# Altium project Carduino_Pi_v1.PrjPcb
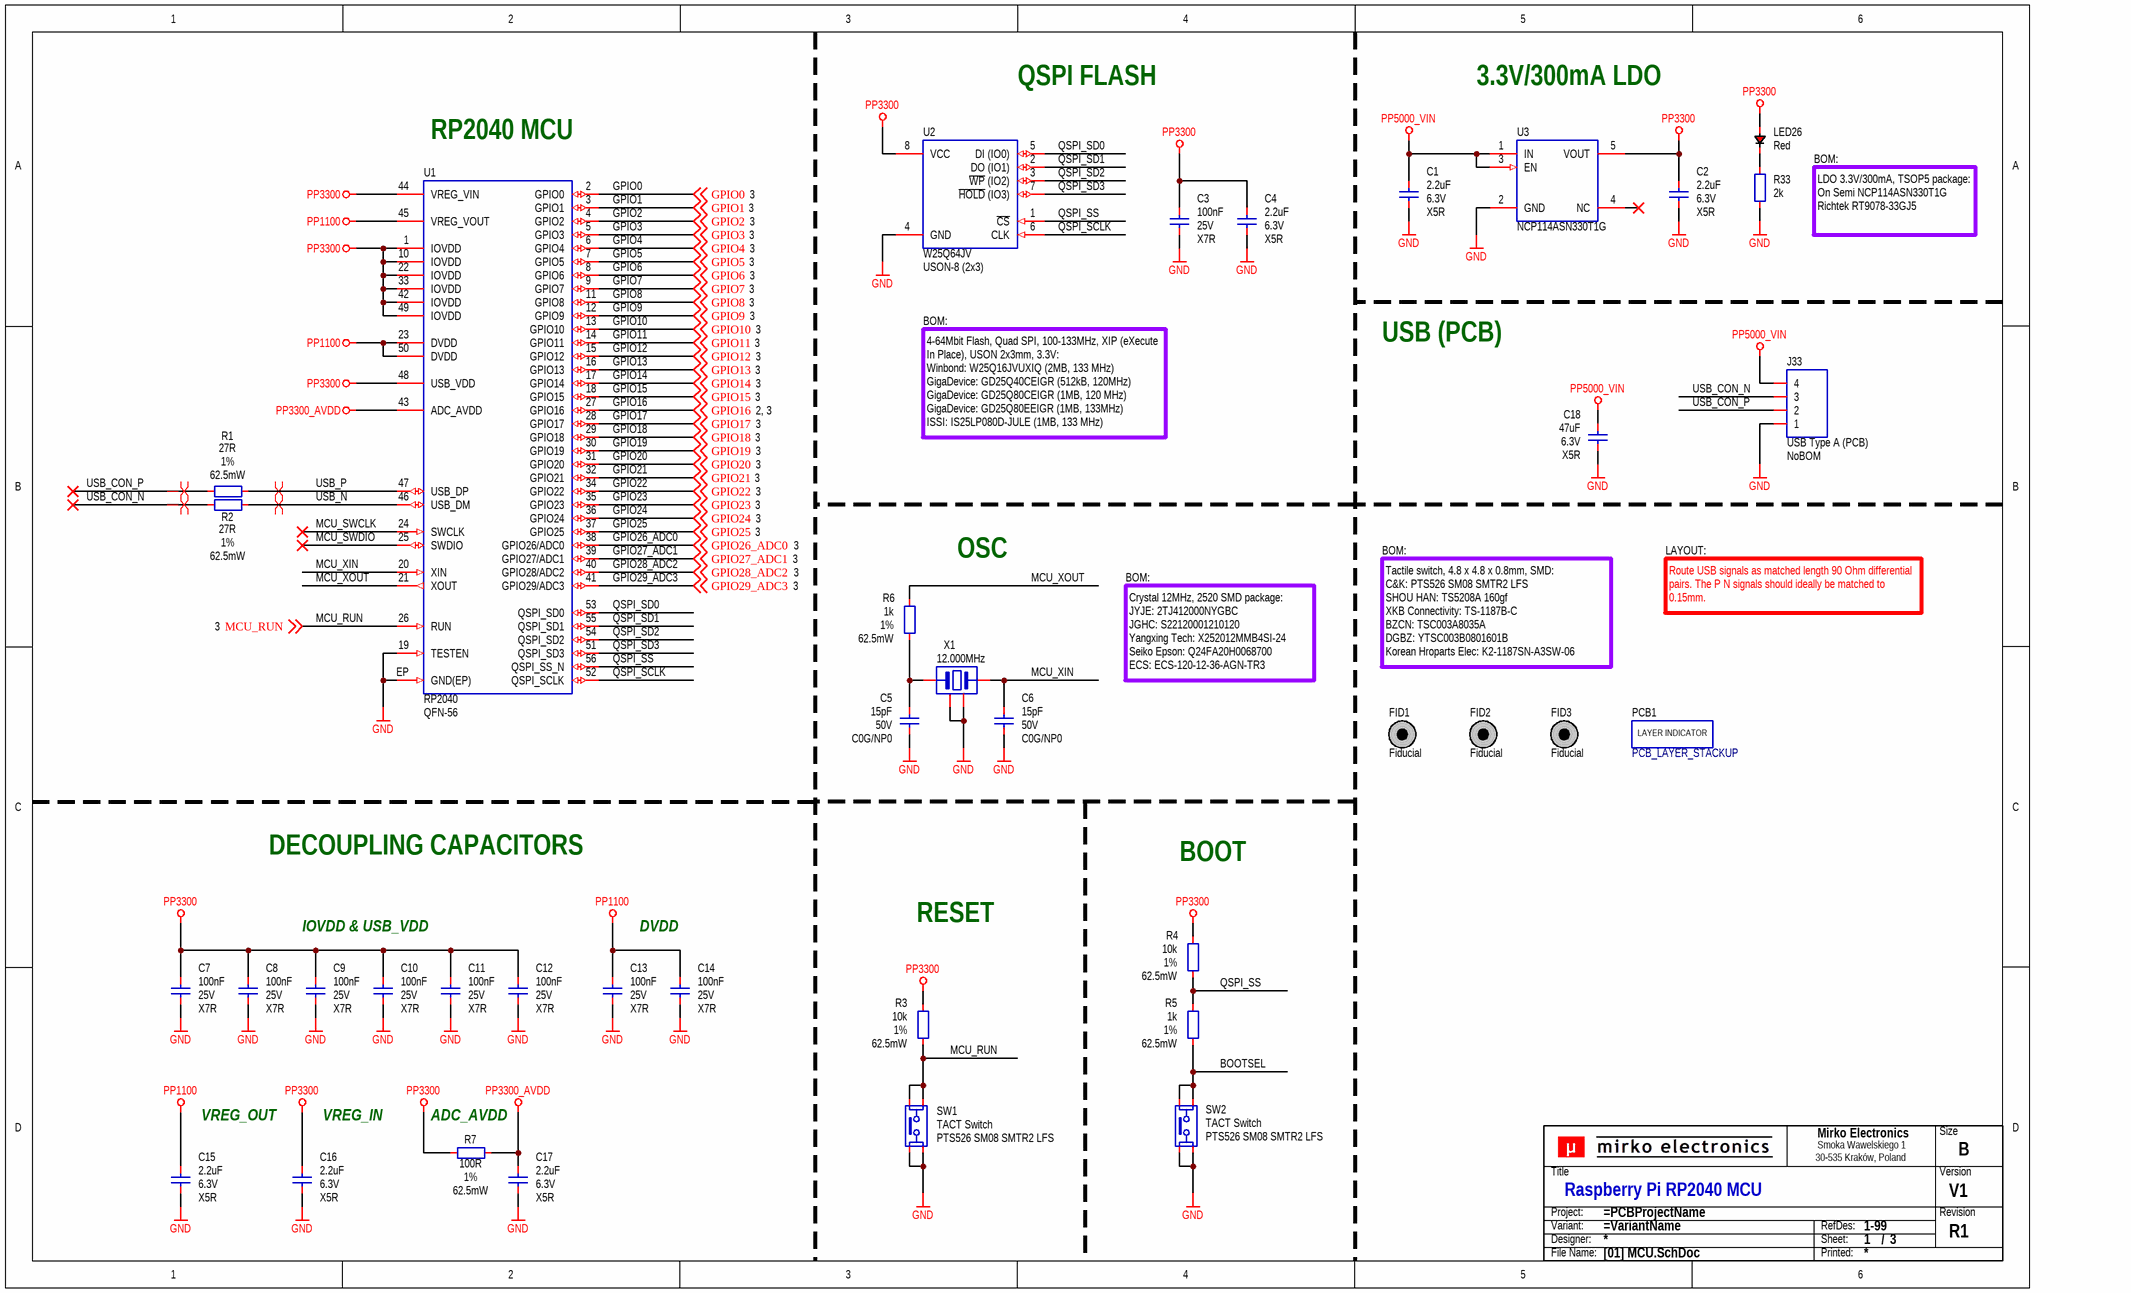
[diagram p0: [01] MCU.SchDoc]
SchPcbRevision: R1; SchPcbVersion: V1
3 sheets, 101 parts. Net scope: global (net labels, ports and power ports of the same name join across sheets).
Board files: Carduino_Pi_v1.PcbDoc, Carduino_Pi_v1_panel.PcbDoc
Sheets:
  [01] MCU.SchDoc
  [02] LED.SchDoc
  [03] Arduino.SchDoc

## Sheet [01] MCU.SchDoc: Raspberry Pi RP2040 MCU
size B; DocumentNumber: 1; SheetNumber: 1; SheetTotal: 3; PageSize: B; Designators: 1-99

### Parts
(Parts that share a designator on the sheet are numbered #1, #2 ... from top to bottom, then left to right.)
C1  2.2uF  Voltage Rating: 6.3V  Dielectric: X5R  [CAP_0402_R]
C2  2.2uF  Voltage Rating: 6.3V  Dielectric: X5R  [CAP_0402_R]
C3  100nF  Voltage Rating: 25V  Dielectric: X7R  [CAP_0402_R]
C4  2.2uF  Voltage Rating: 6.3V  Dielectric: X5R  [CAP_0402_R]
C5  15pF  Voltage Rating: 50V  Dielectric: C0G/NP0  [CAP_0402_R]
C6  15pF  Voltage Rating: 50V  Dielectric: C0G/NP0  [CAP_0402_R]
C7  100nF  Voltage Rating: 25V  Dielectric: X7R  [CAP_0402_R]
C8  100nF  Voltage Rating: 25V  Dielectric: X7R  [CAP_0402_R]
C9  100nF  Voltage Rating: 25V  Dielectric: X7R  [CAP_0402_R]
C10  100nF  Voltage Rating: 25V  Dielectric: X7R  [CAP_0402_R]
C11  100nF  Voltage Rating: 25V  Dielectric: X7R  [CAP_0402_R]
C12  100nF  Voltage Rating: 25V  Dielectric: X7R  [CAP_0402_R]
C13  100nF  Voltage Rating: 25V  Dielectric: X7R  [CAP_0402_R]
C14  100nF  Voltage Rating: 25V  Dielectric: X7R  [CAP_0402_R]
C15  2.2uF  Voltage Rating: 6.3V  Dielectric: X5R  [CAP_0402_R]
C16  2.2uF  Voltage Rating: 6.3V  Dielectric: X5R  [CAP_0402_R]
C17  2.2uF  Voltage Rating: 6.3V  Dielectric: X5R  [CAP_0402_R]
C18  47uF  Voltage Rating: 6.3V  Dielectric: X5R  [CAP_0603_R]
FID1  Fiducial  [PCB_FID_RND_100x300]  (no BOM)
FID2  Fiducial  [PCB_FID_RND_100x300]  (no BOM)
FID3  Fiducial  [PCB_FID_RND_100x300]  (no BOM)
J33  USB Type A (PCB)  BOM: NoBOM  [PCB_USB_SMD_TYPE_A_4P]  (no BOM)
LED26  Red  [LED_0402_R]
PCB1  PCB_LAYER_STACKUP  [PCB_STACKUP-2L_A1]  (no BOM)
R1  27R  Tolerance: 1%  Power Rating: 62.5mW  [RES_0402_R]
R2  27R  Tolerance: 1%  Power Rating: 62.5mW  [RES_0402_R]
R3  10k  Tolerance: 1%  Power Rating: 62.5mW  [RES_0402_R]
R4  10k  Tolerance: 1%  Power Rating: 62.5mW  [RES_0402_R]
R5  1k  Tolerance: 1%  Power Rating: 62.5mW  [RES_0402_R]
R6  1k  Tolerance: 1%  Power Rating: 62.5mW  [RES_0402_R]
R7  100R  Tolerance: 1%  Power Rating: 62.5mW  [RES_0402_R]
R33  2k  [RES_0402_R]
SW1  TACT Switch  MPN: PTS526 SM08 SMTR2 LFS  [SWI_C&K_PTS526SX08]
SW2  TACT Switch  MPN: PTS526 SM08 SMTR2 LFS  [SWI_C&K_PTS526SX08]
TB?#1  Title block  (value not drawn)  (graphical)
U1  RP2040  Package (Case): QFN-56  [ICC_QFN56_700X700X90_P40_EP_RP2040]
U2  W25Q64JV  Package: USON-8 (2x3)  [ICC_USON8_200X300X55P50_EP]
U3  NCP114ASN330T1G  [ICC_TSOT-5_290X160H110_P95]
X1  12.000MHz  [OSC_2520_4P_250X200H50_R]

### Nets
GND: C1.1 C2.1 C3.1 C4.1 C5.1 C6.1 C7.1 C8.1 C9.1 C10.1 C11.1 C12.1 C13.1 C14.1 C15.1 C16.1 C17.1 C18.1 J33.1 R33.1 SW1.3 SW1.4 SW2.3 SW2.4 U1.19(TESTEN) U1.EP(GND(EP)) U2.4(GND) U3.2(GND) X1.2 X1.4
PP1100: C13.2 C14.2 C15.2 U1.23(DVDD) U1.45(VREG_VOUT) U1.50(DVDD)
PP3300: C2.2 C3.2 C4.2 C7.2 C8.2 C9.2 C10.2 C11.2 C12.2 C16.2 LED26.2 R3.2 R4.2 R7.2 U1.1(IOVDD) U1.10(IOVDD) U1.22(IOVDD) U1.33(IOVDD) U1.42(IOVDD) U1.44(VREG_VIN) U1.48(USB_VDD) U1.49(IOVDD) U2.8(VCC) U3.5(VOUT)
PP3300_AVDD: C17.2 R7.1 U1.43(ADC_AVDD)
PP5000_VIN: C1.2 C18.2 J33.4 U3.1(IN) U3.3(EN)
BOOTSEL: R5.1 SW2.1 SW2.2
GPIO0: U1.2(GPIO0) ; off-sheet GPIO0
GPIO1: U1.3(GPIO1) ; off-sheet GPIO1
GPIO2: U1.4(GPIO2) ; off-sheet GPIO2
GPIO3: U1.5(GPIO3) ; off-sheet GPIO3
GPIO4: U1.6(GPIO4) ; off-sheet GPIO4
GPIO5: U1.7(GPIO5) ; off-sheet GPIO5
GPIO6: U1.8(GPIO6) ; off-sheet GPIO6
GPIO7: U1.9(GPIO7) ; off-sheet GPIO7
GPIO8: U1.11(GPIO8) ; off-sheet GPIO8
GPIO9: U1.12(GPIO9) ; off-sheet GPIO9
GPIO10: U1.13(GPIO10) ; off-sheet GPIO10
GPIO11: U1.14(GPIO11) ; off-sheet GPIO11
GPIO12: U1.15(GPIO12) ; off-sheet GPIO12
GPIO13: U1.16(GPIO13) ; off-sheet GPIO13
GPIO14: U1.17(GPIO14) ; off-sheet GPIO14
GPIO15: U1.18(GPIO15) ; off-sheet GPIO15
GPIO16: U1.27(GPIO16) ; off-sheet GPIO16
GPIO17: U1.28(GPIO17) ; off-sheet GPIO17
GPIO18: U1.29(GPIO18) ; off-sheet GPIO18
GPIO19: U1.30(GPIO19) ; off-sheet GPIO19
GPIO20: U1.31(GPIO20) ; off-sheet GPIO20
GPIO21: U1.32(GPIO21) ; off-sheet GPIO21
GPIO22: U1.34(GPIO22) ; off-sheet GPIO22
GPIO23: U1.35(GPIO23) ; off-sheet GPIO23
GPIO24: U1.36(GPIO24) ; off-sheet GPIO24
GPIO25: U1.37(GPIO25) ; off-sheet GPIO25
GPIO26_ADC0: U1.38(GPIO26/ADC0) ; off-sheet GPIO26_ADC0
GPIO27_ADC1: U1.39(GPIO27/ADC1) ; off-sheet GPIO27_ADC1
GPIO28_ADC2: U1.40(GPIO28/ADC2) ; off-sheet GPIO28_ADC2
GPIO29_ADC3: U1.41(GPIO29/ADC3) ; off-sheet GPIO29_ADC3
MCU_RUN: R3.1 SW1.1 SW1.2 U1.26(RUN) ; off-sheet MCU_RUN
MCU_SWCLK: U1.24(SWCLK)
MCU_SWDIO: U1.25(SWDIO)
MCU_XIN: C6.2 U1.20(XIN) X1.3
MCU_XOUT: R6.1 U1.21(XOUT)
QSPI_SCLK: U1.52(QSPI_SCLK) U2.6(CLK)
QSPI_SD0: U1.53(QSPI_SD0) U2.5(DI_(IO0))
QSPI_SD1: U1.55(QSPI_SD1) U2.2(DO_(IO1))
QSPI_SD2: U1.54(QSPI_SD2) U2.3(~{WP}_(IO2))
QSPI_SD3: U1.51(QSPI_SD3) U2.7(~{HOLD}_(IO3))
QSPI_SS: R4.1 R5.2 U1.56(QSPI_SS_N) U2.1(~{CS})
USB_CON_N: J33.3 R2.1
USB_CON_P: J33.2 R1.1
USB_N: R2.2 U1.46(USB_DM)
USB_P: R1.2 U1.47(USB_DP)
NetC5_2: C5.2 R6.2 X1.1
NetLED26_1: LED26.1 R33.2

Not connected (* = marked no-connect by the designer): U3 4(NC)*

### Layout directives
differential pair: USB_CON_N, USB_CON_P, USB_N, USB_P

### Notes on the sheet
- QSPI FLASH
- 3.3V/300mA LDO
- (near U1) RP2040 MCU
- BOM:
- LDO 3.3V/300mA, TSOP5 package:
  On Semi NCP114ASN330T1G
  Richtek RT9078-33GJ5
- USB (PCB)
- 4-64Mbit Flash, Quad SPI, 100-133MHz, XIP (eXecute In Place), USON 2x3mm, 3.3V:
  Winbond: W25Q16JVUXIQ (2MB, 133 MHz)
  GigaDevice: GD25Q40CEIGR (512kB, 120MHz)
  GigaDevice: GD25Q80CEIGR (1MB, 120 MHz)
  GigaDevice: GD25Q80EEIGR (1MB, 133MHz)
  ISSI: IS25LP080D-JULE (1MB, 133 MHz)
- OSC
- LAYOUT:
- Route USB signals as matched length 90 Ohm differential pairs. The P N signals should ideally be matched to 0.15mm.
- Crystal 12MHz, 2520 SMD package:
  JYJE: 2TJ412000NYGBC
  JGHC: S22120001210120
  Yangxing Tech: X252012MMB4SI-24
  Seiko Epson: Q24FA20H0068700
  ECS: ECS-120-12-36-AGN-TR3
- Tactile switch, 4.8 x 4.8 x 0.8mm, SMD:
  C&K: PTS526 SM08 SMTR2 LFS
  SHOU HAN: TS5208A 160gf
  XKB Connectivity: TS-1187B-C
  BZCN: TSC003A8035A
  DGBZ: YTSC003B0801601B
  Korean Hroparts Elec: K2-1187SN-A3SW-06
- DECOUPLING CAPACITORS
- BOOT
- IOVDD & USB_VDD
- DVDD
- RESET
- VREG_OUT
- VREG_IN
- (near R7) ADC_AVDD
- (in symbol PCB_LAYER_STACKUP) LAYER INDICATOR
- (in symbol SCH_TITLE_BLOCK_V1) Mirko Electronics; Size; Smoka Wawelskiego 1; 30-535 Kraków, Poland; Title; Version; Project:; Revision; Variant:; RefDes:; Designer:; Sheet:; /; File Name:; Printed:

### Library data of the parts
C1 C2 C4 C15-C17 = CAP-0026: Capacitor; MLCC; GENERIC; TBD; TBD; TBD; TBD; SMD; 0402 (1005);; Manufacturer: Samsung Electro-Mechanics; MPN: CL05A225MQ5NNNC; Component Body: 1.00 x 0.50mm; ID: CAP-0026; Component Type: Capacitor; Component Subtype: MLCC; Value: 2.2uF; Mounting Type: SMD; Package (Case): 0402 (1005); Component Height: TBD; Packaging Type: TBD; ROHS Status: TBD; Operating Temperature: TBD; Capacitance: 2.2uF; Tolerance: TBD; Features: TBD; Supplier 1: LCSC; Supplier 2: Farnell; Supplier Part Number 1: C107371; Supplier Part Number 2: 3013335; Supplier 3: Mouser; Supplier Part Number 3: 187-CL05A225MQ5NNNC
C3 C7-C14 = CAP-0026: Capacitor; MLCC; GENERIC; TBD; TBD; TBD; TBD; SMD; 0402 (1005);; Manufacturer: Samsung Electro-Mechanics; MPN: CL05B104KA5NNNC; Component Body: 1.00 x 0.50mm; ID: CAP-0026; Component Type: Capacitor; Component Subtype: MLCC; Value: 100nF; Mounting Type: SMD; Package (Case): 0402 (1005); Component Height: TBD; Packaging Type: TBD; ROHS Status: TBD; Operating Temperature: TBD; Capacitance: 100nF; Tolerance: TBD; Features: TBD; Supplier 1: LCSC; Supplier 2: Farnell; Supplier Part Number 1: C155422; Supplier Part Number 2: 2496772; Supplier 3: Mouser; Supplier Part Number 3: 187-CL05B104KA5NNNC
C5 C6 = CAP-0026: Capacitor; MLCC; GENERIC; TBD; TBD; TBD; TBD; SMD; 0402 (1005);; Manufacturer: KEMET Corporation; MPN: C0402C150J5GACTU; Component Body: 1.00 x 0.50mm; ID: CAP-0026; Component Type: Capacitor; Component Subtype: MLCC; Value: 15pF; Mounting Type: SMD; Package (Case): 0402 (1005); Component Height: TBD; Packaging Type: TBD; ROHS Status: TBD; Operating Temperature: TBD; Capacitance: 15pF; Tolerance: TBD; Features: TBD; Supplier 1: LCSC; Supplier 2: Farnell; Supplier Part Number 1: C106997; Supplier Part Number 2: 1414577; Supplier 3: Mouser; Supplier Part Number 3: 80-C0402C150J5G
C18 = CAP-0023: Capacitor; MLCC; GENERIC; TBD; TBD; TBD; TBD; SMD; 0603 (1608);; Manufacturer: Murata Electronics; ID: CAP-0023; Component Type: Capacitor; Component Subtype: MLCC; Value: 47uF; MPN: GENERIC; Mounting Type: SMD; Package (Case): 0603 (1608); Component Body: TBD; Component Height: TBD; Packaging Type: TBD; ROHS Status: TBD; Operating Temperature: TBD; Capacitance: 47uF; Tolerance: TBD; Features: TBD; Supplier 1: LCSC; Supplier 2: Farnell; Supplier 3: Mouser; Supplier Part Number 1: C140782; Supplier Part Number 2: 3582851; Supplier Part Number 3: 81-GRM188R60J476ME5J
FID1-FID3 = PCB_FID_RND: PCB Marking; Fiducial; Round;; Value: Fiducial; Component Subtype: -; Component Type: Fiducial; Mounting Type: -; Supplier 1: LCSC; Supplier 2: Farnell; Supplier 3: Mouser
J33 = CON_1X04_COL: Connector; 1 Row;; Value: USB Type A (PCB); Supplier 1: LCSC; Supplier 2: Farnell; Supplier 3: Mouser
LED26 = DIO_LED_RED: Diode; LED; Red;; Component Subtype: LED Diode; Package (Case): 0402 (1005); Value: Red; Component Type: LED; Mounting Type: SMD; Supplier 1: LCSC; Supplier 2: Farnell; Supplier Part Number 1: C965790; Supplier Part Number 2: 2900754; Supplier 3: Mouser; Supplier Part Number 3: 710-150040RS73240
R1 R2 = RES-0058: Resistor; Thick Film; GENERIC; TBD; TBD; TBD; TBD; TBD; SMD; 0402 (1005);; Manufacturer: Yageo Corporation; MPN: RC0402FR-0727RL; Component Body: 1.00 x 0.50mm; Voltage Rating: 50V; ID: RES-0058; Component Type: Resistor; Component Subtype: Thick Film; Value: 27R; Mounting Type: SMD; Package (Case): 0402 (1005); Component Height: TBD; Packaging Type: TBD; ROHS Status: TBD; Operating Temperature: TBD; Resistance: 27R; TCR: TBD; Features: TBD; Supplier 1: LCSC; Supplier 2: Farnell; Supplier Part Number 1: C138021; Supplier Part Number 2: 9239049; Supplier 3: Mouser; Supplier Part Number 3: 603-RC0402FR-0727RL
R3 R4 = RES-0004: Resistor; Thick Film; 10k; 1%; 62.5mW; 100PPM; 50V; Standard; SMD; 0402 (1005);; Manufacturer: Yageo Corporation; MPN: RC0402FR-0710KL; Component Body: 1.00 x 0.50mm; Packaging Type: Tape & Reel; ID: RES-0004; Component Type: Resistor; Component Subtype: Thick Film; Value: 10k; Mounting Type: SMD; Package (Case): 0402 (1005); Component Height: 0.35mm; ROHS Status: RoHS Compliant; Operating Temperature: -55°C to +155°C; Resistance: 10k; TCR: 100PPM; Voltage Rating: 50V; Features: Standard; Supplier 1: LCSC; Supplier 2: Farnell; Supplier Part Number 1: C60490; Supplier Part Number 2: 9239359; Supplier 3: Mouser; Supplier Part Number 3: 603-RC0402FR-0710KL
R5 R6 = RES-0003: Resistor; Thick Film; 1k; 1%; 62.5mW; 100PPM; 50V; Standard; SMD; 0402 (1005);; Manufacturer: Yageo Corporation; MPN: RC0402FR-071KL; Component Body: 1.00 x 0.50mm; Packaging Type: Tape & Reel; ID: RES-0003; Component Type: Resistor; Component Subtype: Thick Film; Value: 1k; Mounting Type: SMD; Package (Case): 0402 (1005); Component Height: 0.35mm; ROHS Status: RoHS Compliant; Operating Temperature: -55°C to +155°C; Resistance: 1k; TCR: 100PPM; Voltage Rating: 50V; Features: Standard; Supplier 1: LCSC; Supplier 2: Farnell; Supplier Part Number 1: C106235; Supplier Part Number 2: 9239235; Supplier 3: Mouser; Supplier Part Number 3: 603-RC0402FR-071KL
R7 = RES-0002: Resistor; Thick Film; 100R; 1%; 62.5mW; 100PPM; 50V; Standard; SMD; 0402 (1005);; Manufacturer: Yageo Corporation; MPN: RC0402FR-07100RL; Component Body: 1.00 x 0.50mm; Packaging Type: Tape & Reel; ID: RES-0002; Component Type: Resistor; Component Subtype: Thick Film; Value: 100R; Mounting Type: SMD; Package (Case): 0402 (1005); Component Height: 0.35mm; ROHS Status: RoHS Compliant; Operating Temperature: -55°C to +155°C; Resistance: 100R; TCR: 100PPM; Voltage Rating: 50V; Features: Standard; Supplier 1: LCSC; Supplier 2: Farnell; Supplier Part Number 1: C106232; Supplier Part Number 2: 2421888; Supplier 3: Mouser; Supplier Part Number 3: 603-RC0402FR-07100RL
R33 = RES-0058: Resistor; Thick Film; GENERIC; TBD; TBD; TBD; TBD; TBD; SMD; 0402 (1005);; Manufacturer: Yageo Corporation; MPN: RC0402FR-072KP; Component Body: 1.00 x 0.50mm; Tolerance: 1%; Power Rating: 62.5mW; Voltage Rating: 50V; ID: RES-0058; Component Type: Resistor; Component Subtype: Thick Film; Value: 2k; Mounting Type: SMD; Package (Case): 0402 (1005); Component Height: TBD; Packaging Type: TBD; ROHS Status: TBD; Operating Temperature: TBD; Resistance: 2k; TCR: TBD; Features: TBD; Supplier 1: LCSC; Supplier 2: Farnell; Supplier Part Number 1: C60488; Supplier Part Number 2: 1458757; Supplier 3: Mouser; Supplier Part Number 3: 603-RC0402FR-072KL
SW1 SW2 = SWI_TACT_4P_AABB: Switch; Tactile; Monostable;; Manufacturer: C&K Switches; Package (Case): 3780595; Value: TACT Switch; Component Subtype: TACT Switch; Component Type: Switch; Mounting Type: SMD; Supplier 1: LCSC; Supplier 2: Farnell; Supplier Part Number 1: C2681473; Supplier Part Number 2: 3780595; Supplier 3: Mouser; Supplier Part Number 3: 611-PTS526SM08SMTR2L
TB?#1 = SCH_TITLE_BLOCK_V1: Component Type: Title block; Manufacturer: -; Mounting Type: Non component; MPN: -; Operating Temperature: -; Package: -; Specification: Title block; Value: Title block; Replacement: -; System: ?
U1 = ICC_RPI_RP2040_QFN56: IC; MCU;; Manufacturer: Raspberry Pi; Component Subtype: MCU; Component Type: IC; Mounting Type: SMD; MPN: RP2040; Value: RP2040; Supplier 1: LCSC; Supplier Part Number 1: C2040; Supplier 2: Farnell; Supplier Part Number 2: 3766082; Supplier 3: Mouser; Supplier Part Number 3: 358-RP2040CHIP-7-500
U2 = ICC_WBD_W25Q64_SOIC_WSON: ICC; Manufacturer: Winbond Electronics; MPN: W25Q16JVUXIQ; Specification: Serial Flash memory, 64Mbit, standard-, dual-, Quad- SPI interface, 133MHz, WSON 5x6mm package; Component Type: IC; Mounting Type: SMD; Operating Temperature: -40°C to +85°C; Value: W25Q64JV; Supplier 1: LCSC; Supplier 2: Farnell; Supplier Part Number 1: C2843335; Supplier 3: Mouser; Supplier Part Number 3: 454-W25Q16JVUXIQTR
U3 = ICC_ONS_NCP114_TSOP5: ICC; LDO;; MPN: NCP114ASN330T1G; Supplier 1: LCSC; Supplier 2: Farnell; Supplier 3: Mouser; Supplier Part Number 1: C457666; Supplier Part Number 2: 2677151; Supplier Part Number 3: 863-NCP114ASN330T1G; Value: NCP114ASN330T1G
X1 = OSC_XTL_P4: Oscillator; Crystal;; Manufacturer: ECS; MPN: ECS-120-12-36-AGN-TR3; Value: 12.000MHz; Component Subtype: Crystal; Component Type: Crystal; Mounting Type: SMD; Package (Case): SMD 2520; Supplier 1: LCSC; Supplier 2: Farnell; Supplier Part Number 1: C2149205; Supplier Part Number 2: 2849406; Supplier 3: Mouser; Supplier Part Number 3: 520-120-12-36AGN-TR3
PCB1 = PCB_LAYER_STACKUP: Component Subtype: -; Component Type: PCB Marking; Mounting Type: -; Supplier 1: LCSC; Supplier 2: Farnell; Supplier 3: Mouser

## Sheet [02] LED.SchDoc: RGB Ring LED
size B; DocumentNumber: 2; SheetNumber: 2; SheetTotal: 3; PageSize: B; Designators: 1-99
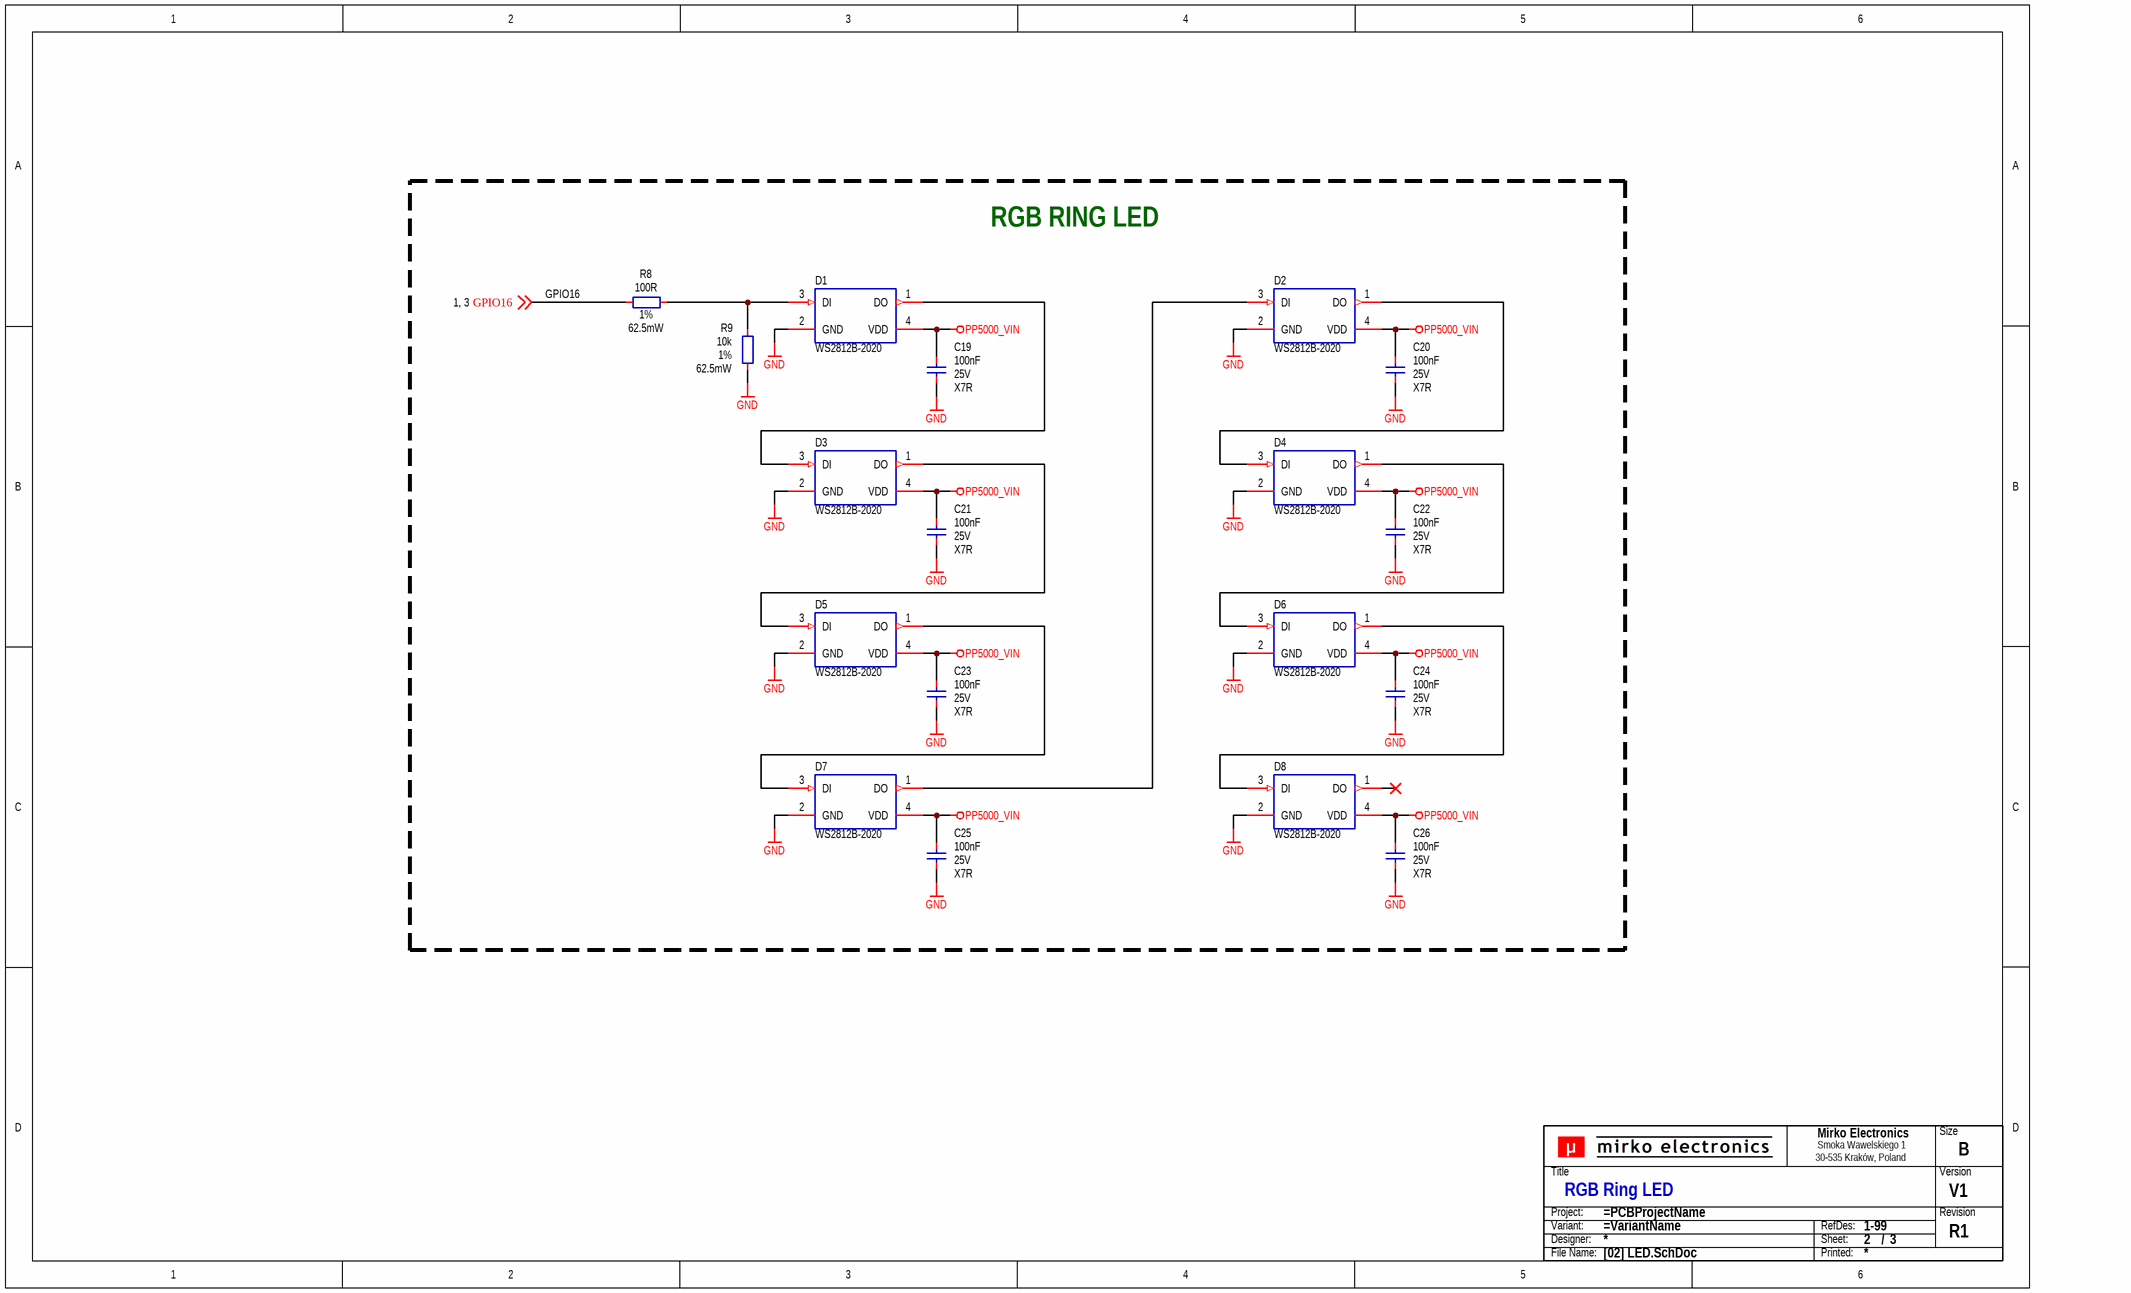
[diagram p1: [02] LED.SchDoc]

### Parts
(Parts that share a designator on the sheet are numbered #1, #2 ... from top to bottom, then left to right.)
C19  100nF  Voltage Rating: 25V  Dielectric: X7R  [CAP_0402_R]
C20  100nF  Voltage Rating: 25V  Dielectric: X7R  [CAP_0402_R]
C21  100nF  Voltage Rating: 25V  Dielectric: X7R  [CAP_0402_R]
C22  100nF  Voltage Rating: 25V  Dielectric: X7R  [CAP_0402_R]
C23  100nF  Voltage Rating: 25V  Dielectric: X7R  [CAP_0402_R]
C24  100nF  Voltage Rating: 25V  Dielectric: X7R  [CAP_0402_R]
C25  100nF  Voltage Rating: 25V  Dielectric: X7R  [CAP_0402_R]
C26  100nF  Voltage Rating: 25V  Dielectric: X7R  [CAP_0402_R]
D1  WS2812B-2020  [LED_WRD_WS2812X-2020]
D2  WS2812B-2020  [LED_WRD_WS2812X-2020]
D3  WS2812B-2020  [LED_WRD_WS2812X-2020]
D4  WS2812B-2020  [LED_WRD_WS2812X-2020]
D5  WS2812B-2020  [LED_WRD_WS2812X-2020]
D6  WS2812B-2020  [LED_WRD_WS2812X-2020]
D7  WS2812B-2020  [LED_WRD_WS2812X-2020]
D8  WS2812B-2020  [LED_WRD_WS2812X-2020]
R8  100R  Tolerance: 1%  Power Rating: 62.5mW  [RES_0402_R]
R9  10k  Tolerance: 1%  Power Rating: 62.5mW  [RES_0402_R]
TB?#2  Title block  (value not drawn)  (graphical)

### Blocks framed on the sheet
RGB RING LED: C19-C26 D1-D8 R8 R9

### Nets
GND: C19.1 C20.1 C21.1 C22.1 C23.1 C24.1 C25.1 C26.1 D1.2(GND) D2.2(GND) D3.2(GND) D4.2(GND) D5.2(GND) D6.2(GND) D7.2(GND) D8.2(GND) R9.1
PP5000_VIN: C19.2 C20.2 C21.2 C22.2 C23.2 C24.2 C25.2 C26.2 D1.4(VDD) D2.4(VDD) D3.4(VDD) D4.4(VDD) D5.4(VDD) D6.4(VDD) D7.4(VDD) D8.4(VDD)
GPIO16: R8.2 ; off-sheet GPIO16
NetD1_1: D1.1(DO) D3.3(DI)
NetD1_3: D1.3(DI) R8.1 R9.2
NetD2_1: D2.1(DO) D4.3(DI)
NetD2_3: D2.3(DI) D7.1(DO)
NetD3_1: D3.1(DO) D5.3(DI)
NetD4_1: D4.1(DO) D6.3(DI)
NetD5_1: D5.1(DO) D7.3(DI)
NetD6_1: D6.1(DO) D8.3(DI)

Not connected (* = marked no-connect by the designer): D8 1(DO)*

### Notes on the sheet
- (in symbol SCH_TITLE_BLOCK_V1) Mirko Electronics; Size; Smoka Wawelskiego 1; 30-535 Kraków, Poland; Title; Version; Project:; Revision; Variant:; RefDes:; Designer:; Sheet:; /; File Name:; Printed:

### Library data of the parts
C19-C26 = CAP-0026: as C3 on sheet [01] MCU; ID: CAP-0026; Component Type: Capacitor; Component Subtype: MLCC; Value: 100nF; Mounting Type: SMD; Package (Case): 0402 (1005); Component Height: TBD; Packaging Type: TBD; ROHS Status: TBD; Operating Temperature: TBD; Capacitance: 100nF; Tolerance: TBD; Features: TBD; Supplier 1: LCSC; Supplier 2: Farnell; Supplier Part Number 1: C155422; Supplier Part Number 2: 2496772; Supplier 3: Mouser; Supplier Part Number 3: 187-CL05B104KA5NNNC
D1-D8 = LED_WRD_WS2812B-2020: LED; RGB; Manufacturer: Worldsemi; Specification: Digital LED RGB diode, 12mA, 800kbps, SMD 2020 package; Cross Refference: NO; Component Type: LED Diode; Mounting Type: SMD; MPN: WS2812B-2020; Operating Temperature: -25°C to +85°C; Package (Case): SMD 2020; Value: WS2812B-2020; Supplier 1: LCSC; Supplier Part Number 1: C965555; Supplier 2: Farnell; Supplier 3: Mouser; Supplier Part Number 3: 485-4684 (10-pack)
R8 = RES-0002: as R7 on sheet [01] MCU; ID: RES-0002; Component Type: Resistor; Component Subtype: Thick Film; Value: 100R; Mounting Type: SMD; Package (Case): 0402 (1005); Component Height: 0.35mm; ROHS Status: RoHS Compliant; Operating Temperature: -55°C to +155°C; Resistance: 100R; TCR: 100PPM; Voltage Rating: 50V; Features: Standard; Supplier 1: LCSC; Supplier 2: Farnell; Supplier Part Number 1: C106232; Supplier Part Number 2: 2421888; Supplier 3: Mouser; Supplier Part Number 3: 603-RC0402FR-07100RL
R9 = RES-0004: as R3 on sheet [01] MCU; ID: RES-0004; Component Type: Resistor; Component Subtype: Thick Film; Value: 10k; Mounting Type: SMD; Package (Case): 0402 (1005); Component Height: 0.35mm; ROHS Status: RoHS Compliant; Operating Temperature: -55°C to +155°C; Resistance: 10k; TCR: 100PPM; Voltage Rating: 50V; Features: Standard; Supplier 1: LCSC; Supplier 2: Farnell; Supplier Part Number 1: C60490; Supplier Part Number 2: 9239359; Supplier 3: Mouser; Supplier Part Number 3: 603-RC0402FR-0710KL
TB?#2 = SCH_TITLE_BLOCK_V1: Component Type: Title block; Manufacturer: -; Mounting Type: Non component; MPN: -; Operating Temperature: -; Package: -; Specification: Title block; Value: Title block; Replacement: -; System: ?

## Sheet [03] Arduino.SchDoc: Arduino Uno socket
size B; DocumentNumber: 3; SheetNumber: 3; SheetTotal: 3; Designators: 1-99; PageSize: B
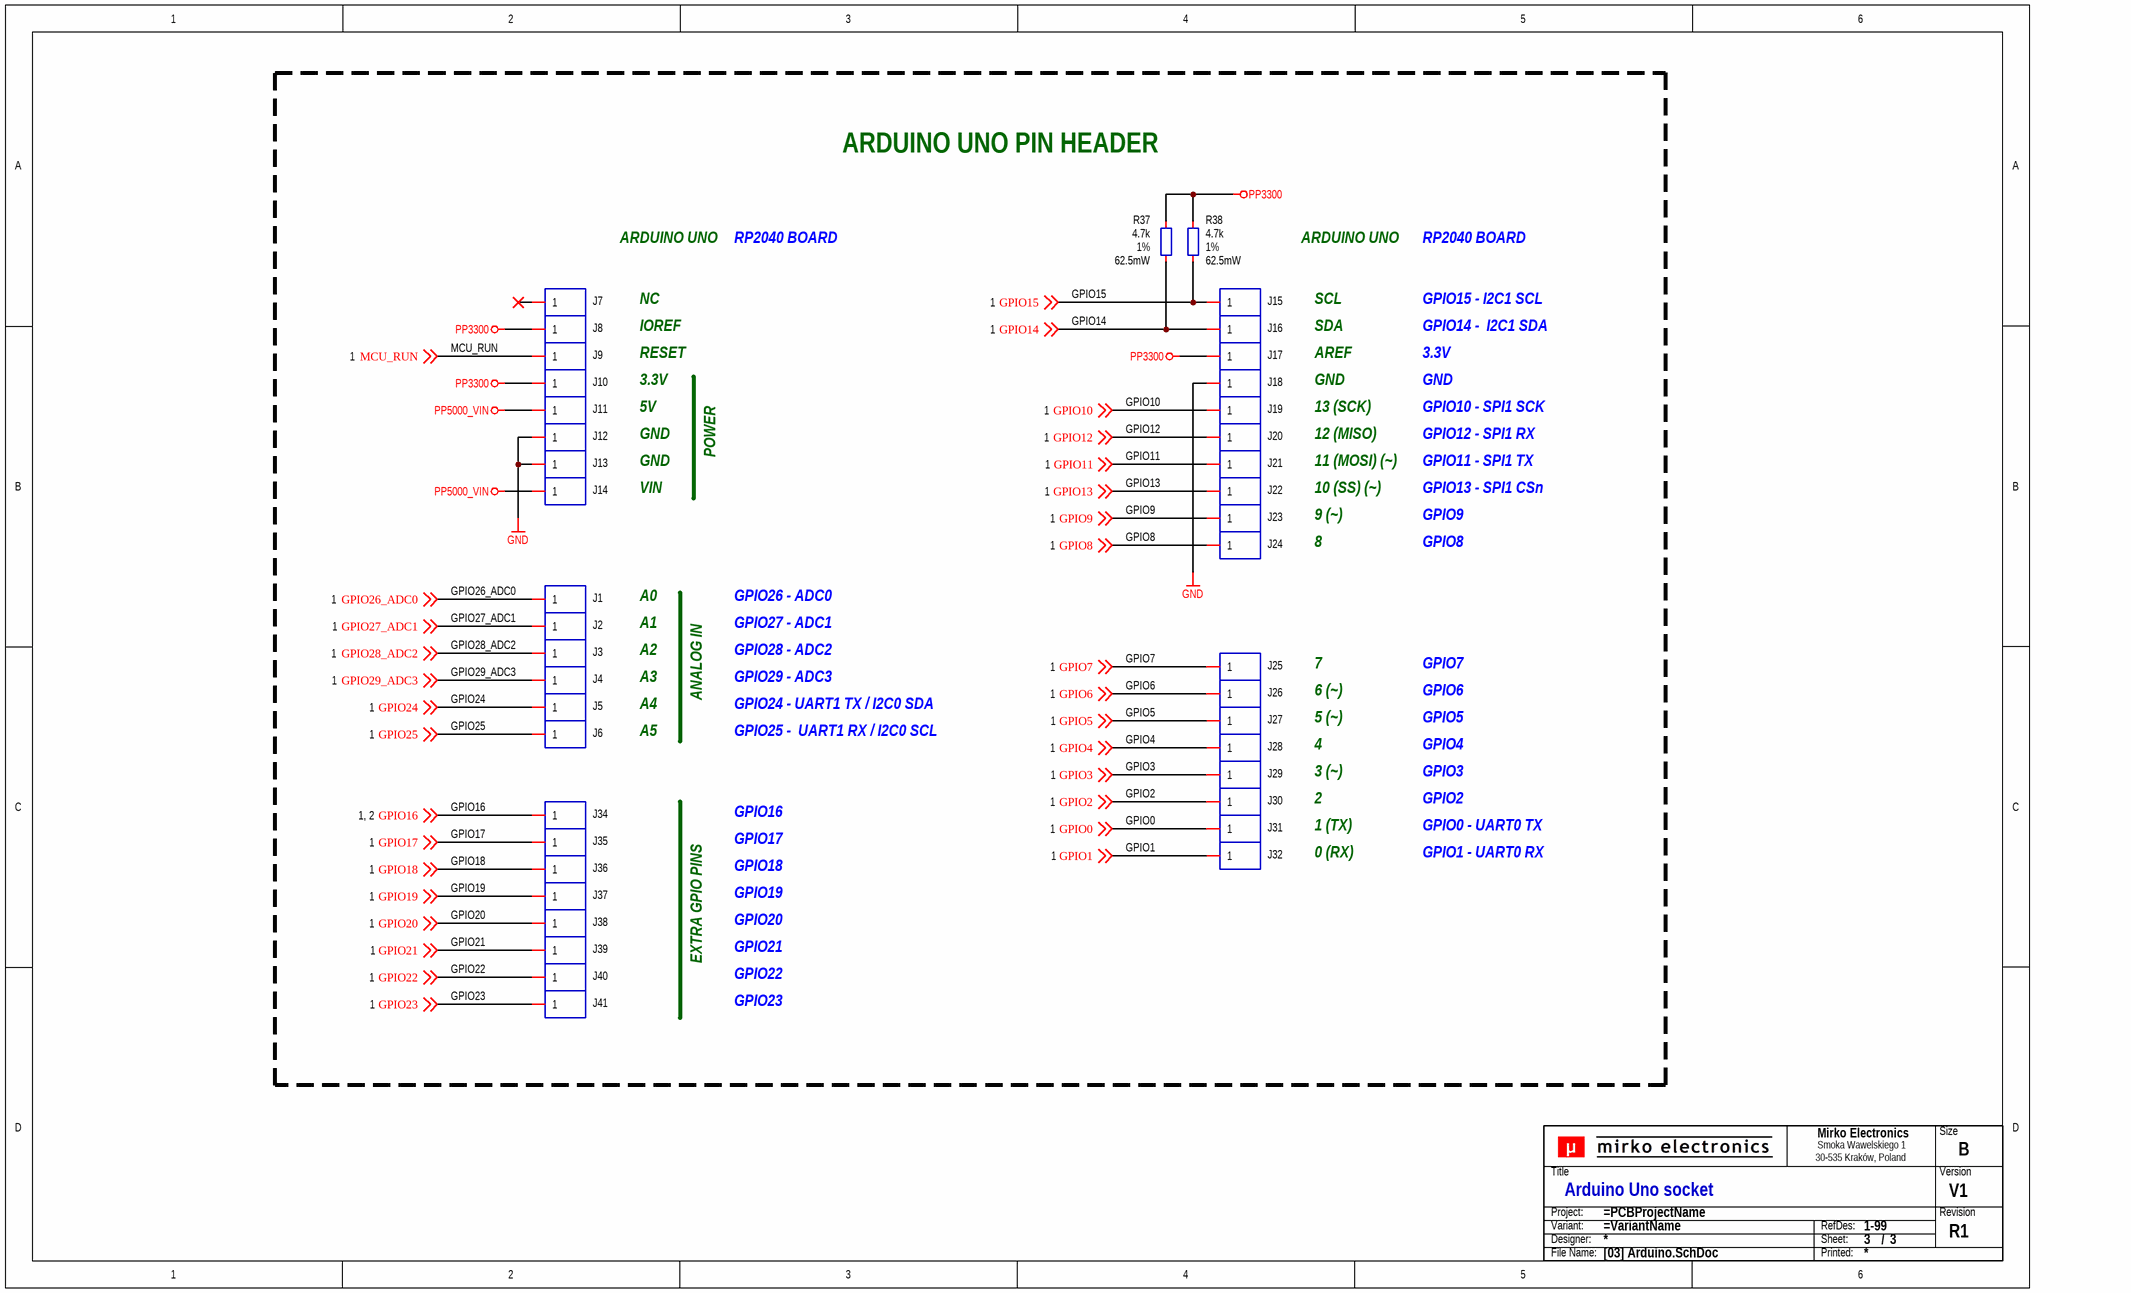
[diagram p2: [03] Arduino.SchDoc]

### Parts
(Parts that share a designator on the sheet are numbered #1, #2 ... from top to bottom, then left to right.)
J1  (no value)  [PCB_PAD_THT_280X180H100_RND]  (no BOM)
J2  (no value)  [PCB_PAD_THT_280X180H100_RND]  (no BOM)
J3  (no value)  [PCB_PAD_THT_280X180H100_RND]  (no BOM)
J4  (no value)  [PCB_PAD_THT_280X180H100_RND]  (no BOM)
J5  (no value)  [PCB_PAD_THT_280X180H100_RND]  (no BOM)
J6  (no value)  [PCB_PAD_THT_280X180H100_RND]  (no BOM)
J7  (no value)  [PCB_PAD_THT_280X180H100_RND]  (no BOM)
J8  (no value)  [PCB_PAD_THT_280X180H100_RND]  (no BOM)
J9  (no value)  [PCB_PAD_THT_280X180H100_RND]  (no BOM)
J10  (no value)  [PCB_PAD_THT_280X180H100_RND]  (no BOM)
J11  (no value)  [PCB_PAD_THT_280X180H100_RND]  (no BOM)
J12  (no value)  [PCB_PAD_THT_280X180H100_RND]  (no BOM)
J13  (no value)  [PCB_PAD_THT_280X180H100_RND]  (no BOM)
J14  (no value)  [PCB_PAD_THT_280X180H100_RND]  (no BOM)
J15  (no value)  [PCB_PAD_THT_280X180H100_RND]  (no BOM)
J16  (no value)  [PCB_PAD_THT_280X180H100_RND]  (no BOM)
J17  (no value)  [PCB_PAD_THT_280X180H100_RND]  (no BOM)
J18  (no value)  [PCB_PAD_THT_280X180H100_RND]  (no BOM)
J19  (no value)  [PCB_PAD_THT_280X180H100_RND]  (no BOM)
J20  (no value)  [PCB_PAD_THT_280X180H100_RND]  (no BOM)
J21  (no value)  [PCB_PAD_THT_280X180H100_RND]  (no BOM)
J22  (no value)  [PCB_PAD_THT_280X180H100_RND]  (no BOM)
J23  (no value)  [PCB_PAD_THT_280X180H100_RND]  (no BOM)
J24  (no value)  [PCB_PAD_THT_280X180H100_RND]  (no BOM)
J25  (no value)  [PCB_PAD_THT_280X180H100_RND]  (no BOM)
J26  (no value)  [PCB_PAD_THT_280X180H100_RND]  (no BOM)
J27  (no value)  [PCB_PAD_THT_280X180H100_RND]  (no BOM)
J28  (no value)  [PCB_PAD_THT_280X180H100_RND]  (no BOM)
J29  (no value)  [PCB_PAD_THT_280X180H100_RND]  (no BOM)
J30  (no value)  [PCB_PAD_THT_280X180H100_RND]  (no BOM)
J31  (no value)  [PCB_PAD_THT_280X180H100_RND]  (no BOM)
J32  (no value)  [PCB_PAD_THT_280X180H100_RND]  (no BOM)
J34  (no value)  [PCB_PAD_THT_280X180H100_RND]  (no BOM)
J35  (no value)  [PCB_PAD_THT_280X180H100_RND]  (no BOM)
J36  (no value)  [PCB_PAD_THT_280X180H100_RND]  (no BOM)
J37  (no value)  [PCB_PAD_THT_280X180H100_RND]  (no BOM)
J38  (no value)  [PCB_PAD_THT_280X180H100_RND]  (no BOM)
J39  (no value)  [PCB_PAD_THT_280X180H100_RND]  (no BOM)
J40  (no value)  [PCB_PAD_THT_280X180H100_RND]  (no BOM)
J41  (no value)  [PCB_PAD_THT_280X180H100_RND]  (no BOM)
R37  4.7k  Tolerance: 1%  Power Rating: 62.5mW  [RES_0402_R]
R38  4.7k  Tolerance: 1%  Power Rating: 62.5mW  [RES_0402_R]
TB?#3  Title block  (value not drawn)  (graphical)

### Blocks framed on the sheet
ARDUINO UNO PIN HEADER: J1-J32 J34-J41 R37 R38

### Nets
GND: J12.1 J13.1 J18.1
PP3300: J8.1 J10.1 J17.1 R37.2 R38.2
PP5000_VIN: J11.1 J14.1
GPIO0: J31.1 ; off-sheet GPIO0
GPIO1: J32.1 ; off-sheet GPIO1
GPIO2: J30.1 ; off-sheet GPIO2
GPIO3: J29.1 ; off-sheet GPIO3
GPIO4: J28.1 ; off-sheet GPIO4
GPIO5: J27.1 ; off-sheet GPIO5
GPIO6: J26.1 ; off-sheet GPIO6
GPIO7: J25.1 ; off-sheet GPIO7
GPIO8: J24.1 ; off-sheet GPIO8
GPIO9: J23.1 ; off-sheet GPIO9
GPIO10: J19.1 ; off-sheet GPIO10
GPIO11: J21.1 ; off-sheet GPIO11
GPIO12: J20.1 ; off-sheet GPIO12
GPIO13: J22.1 ; off-sheet GPIO13
GPIO14: J16.1 R37.1 ; off-sheet GPIO14
GPIO15: J15.1 R38.1 ; off-sheet GPIO15
GPIO16: J34.1 ; off-sheet GPIO16
GPIO17: J35.1 ; off-sheet GPIO17
GPIO18: J36.1 ; off-sheet GPIO18
GPIO19: J37.1 ; off-sheet GPIO19
GPIO20: J38.1 ; off-sheet GPIO20
GPIO21: J39.1 ; off-sheet GPIO21
GPIO22: J40.1 ; off-sheet GPIO22
GPIO23: J41.1 ; off-sheet GPIO23
GPIO24: J5.1 ; off-sheet GPIO24
GPIO25: J6.1 ; off-sheet GPIO25
GPIO26_ADC0: J1.1 ; off-sheet GPIO26_ADC0
GPIO27_ADC1: J2.1 ; off-sheet GPIO27_ADC1
GPIO28_ADC2: J3.1 ; off-sheet GPIO28_ADC2
GPIO29_ADC3: J4.1 ; off-sheet GPIO29_ADC3
MCU_RUN: J9.1 ; off-sheet MCU_RUN

Not connected (* = marked no-connect by the designer): J7 1*

### Notes on the sheet
- ARDUINO UNO
- RP2040 BOARD
- NC
- IOREF
- RESET
- SCL
- SDA
- AREF
- 3.3V
- GPIO14 -  I2C1 SDA
- GPIO15 - I2C1 SCL
- 5V
- GND
- 13 (SCK)
- GPIO10 - SPI1 SCK
- VIN
- POWER
- 12 (MISO)
- 11 (MOSI) (~)
- 10 (SS) (~)
- GPIO12 - SPI1 RX
- GPIO11 - SPI1 TX
- GPIO13 - SPI1 CSn
- 9 (~)
- 8
- GPIO9
- GPIO8
- A0
- A1
- GPIO26 - ADC0
- GPIO27 - ADC1
- A2
- A3
- ANALOG IN
- GPIO28 - ADC2
- GPIO29 - ADC3
- 6 (~)
- 7
- GPIO6
- GPIO7
- A4
- A5
- GPIO25 -  UART1 RX / I2C0 SCL
- GPIO24 - UART1 TX / I2C0 SDA
- 5 (~)
- 4
- 3 (~)
- GPIO5
- GPIO4
- GPIO3
- GPIO16
- 2
- 1 (TX)
- GPIO2
- GPIO0 - UART0 TX
- GPIO17
- GPIO18
- GPIO19
- 0 (RX)
- GPIO1 - UART0 RX
- EXTRA GPIO PINS
- GPIO20
- GPIO21
- GPIO22
- GPIO23
- (in symbol SCH_TITLE_BLOCK_V1) Mirko Electronics; Size; Smoka Wawelskiego 1; 30-535 Kraków, Poland; Title; Version; Project:; Revision; Variant:; RefDes:; Designer:; Sheet:; /; File Name:; Printed:

### Library data of the parts
J1-J32 J34-J41 = CON_1X01_COL: Connector; 1 Row;; Supplier 1: LCSC; Supplier 2: Farnell; Supplier 3: Mouser
R37 R38 = RES-0019: Resistor; Thick Film; 4.7k; 1%; 62.5mW; 100PPM; 50V; Standard; SMD; 0402 (1005);; Manufacturer: Yageo Corporation; MPN: RC0402FR-074K7L; Component Body: 1.00 x 0.50mm; Packaging Type: Tape & Reel; ID: RES-0019; Component Type: Resistor; Component Subtype: Thick Film; Value: 4.7k; Mounting Type: SMD; Package (Case): 0402 (1005); Component Height: 0.35mm; ROHS Status: RoHS Compliant; Operating Temperature: -55°C to +155°C; Resistance: 4.7k; TCR: 100PPM; Voltage Rating: 50V; Features: Standard; Supplier 1: LCSC; Supplier 2: Farnell; Supplier Part Number 1: C105871; Supplier Part Number 2: 9239316; Supplier 3: Mouser; Supplier Part Number 3: 603-RC0402FR-074K7L
TB?#3 = SCH_TITLE_BLOCK_V1: Component Type: Title block; Manufacturer: -; Mounting Type: Non component; MPN: -; Operating Temperature: -; Package: -; Specification: Title block; Value: Title block; Replacement: -; System: ?

## Nets that join several sheets
GND: [01] MCU (30 pins), [02] LED (17 pins), [03] Arduino (J12.1 J13.1 J18.1)
PP3300: [01] MCU (24 pins), [03] Arduino (5 pins)
PP5000_VIN: [01] MCU (5 pins), [02] LED (16 pins), [03] Arduino (J11.1 J14.1)
GPIO0: [01] MCU (U1.2), [03] Arduino (J31.1)
GPIO1: [01] MCU (U1.3), [03] Arduino (J32.1)
GPIO2: [01] MCU (U1.4), [03] Arduino (J30.1)
GPIO3: [01] MCU (U1.5), [03] Arduino (J29.1)
GPIO4: [01] MCU (U1.6), [03] Arduino (J28.1)
GPIO5: [01] MCU (U1.7), [03] Arduino (J27.1)
GPIO6: [01] MCU (U1.8), [03] Arduino (J26.1)
GPIO7: [01] MCU (U1.9), [03] Arduino (J25.1)
GPIO8: [01] MCU (U1.11), [03] Arduino (J24.1)
GPIO9: [01] MCU (U1.12), [03] Arduino (J23.1)
GPIO10: [01] MCU (U1.13), [03] Arduino (J19.1)
GPIO11: [01] MCU (U1.14), [03] Arduino (J21.1)
GPIO12: [01] MCU (U1.15), [03] Arduino (J20.1)
GPIO13: [01] MCU (U1.16), [03] Arduino (J22.1)
GPIO14: [01] MCU (U1.17), [03] Arduino (J16.1 R37.1)
GPIO15: [01] MCU (U1.18), [03] Arduino (J15.1 R38.1)
GPIO16: [01] MCU (U1.27), [02] LED (R8.2), [03] Arduino (J34.1)
GPIO17: [01] MCU (U1.28), [03] Arduino (J35.1)
GPIO18: [01] MCU (U1.29), [03] Arduino (J36.1)
GPIO19: [01] MCU (U1.30), [03] Arduino (J37.1)
GPIO20: [01] MCU (U1.31), [03] Arduino (J38.1)
GPIO21: [01] MCU (U1.32), [03] Arduino (J39.1)
GPIO22: [01] MCU (U1.34), [03] Arduino (J40.1)
GPIO23: [01] MCU (U1.35), [03] Arduino (J41.1)
GPIO24: [01] MCU (U1.36), [03] Arduino (J5.1)
GPIO25: [01] MCU (U1.37), [03] Arduino (J6.1)
GPIO26_ADC0: [01] MCU (U1.38), [03] Arduino (J1.1)
GPIO27_ADC1: [01] MCU (U1.39), [03] Arduino (J2.1)
GPIO28_ADC2: [01] MCU (U1.40), [03] Arduino (J3.1)
GPIO29_ADC3: [01] MCU (U1.41), [03] Arduino (J4.1)
MCU_RUN: [01] MCU (R3.1 SW1.1 SW1.2 U1.26), [03] Arduino (J9.1)